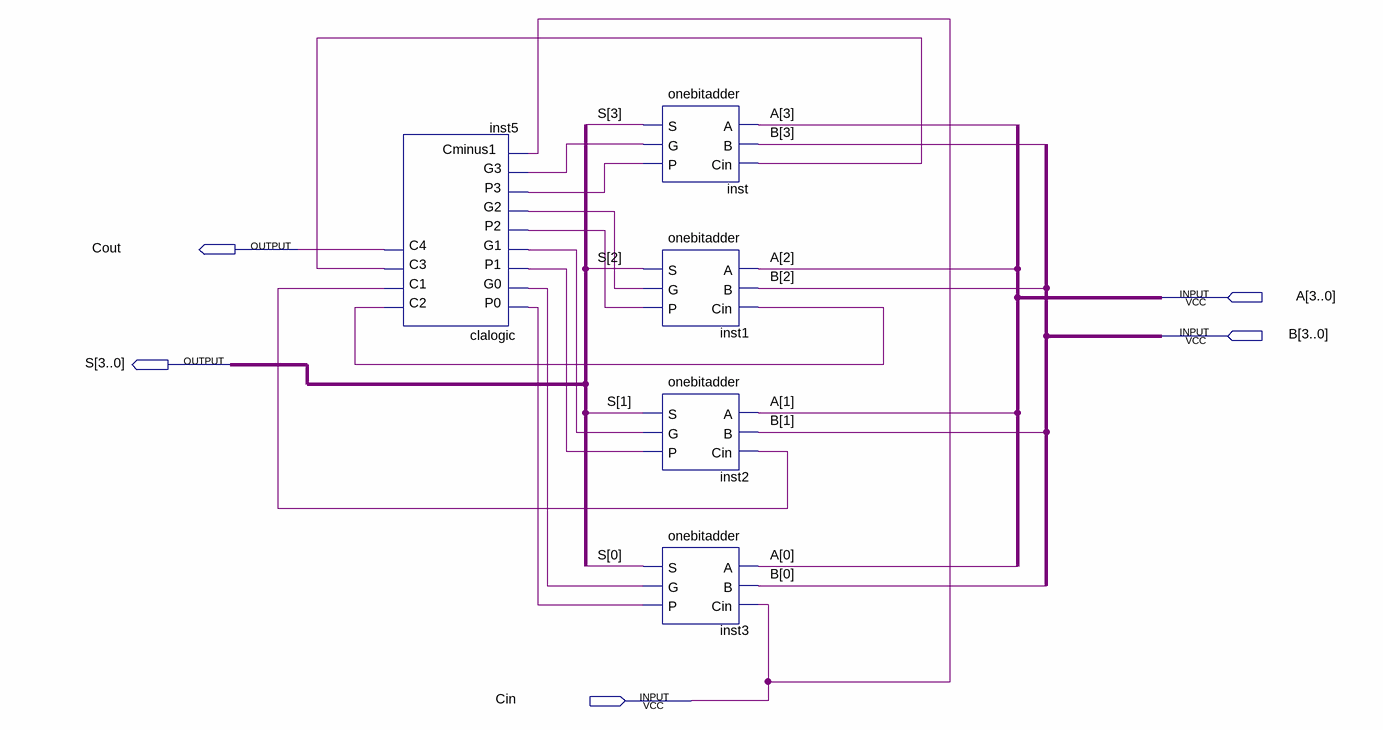
[diagram p0: schematic sheet]
// Quartus schematic finalfourbitadder.bdf as structural Verilog: 5 symbols, 5 pins
module finalfourbitadder (
  input  [3:0] A,
  input  [3:0] B,
  input  Cin,
  output Cout,
  output [3:0] S
);

  wire inst1_g, inst1_p, inst2_g, inst2_p, inst3_g, inst3_p, inst5_c1, inst5_c2, inst5_c3, inst_g, inst_p;

  clalogic inst5 (
    .P0(inst3_p), .G0(inst3_g), .P1(inst2_p), .G1(inst2_g), .P2(inst1_p), .G2(inst1_g), .P3(inst_p),
    .G3(inst_g), .Cminus1(Cin), .C2(inst5_c2), .C1(inst5_c1), .C3(inst5_c3), .C4(Cout));
  onebitadder inst (.A(A[3]), .B(B[3]), .Cin(inst5_c3), .S(S[3]), .G(inst_g), .P(inst_p));
  onebitadder inst1 (.A(A[2]), .B(B[2]), .Cin(inst5_c2), .S(S[2]), .G(inst1_g), .P(inst1_p));
  onebitadder inst2 (.A(A[1]), .B(B[1]), .Cin(inst5_c1), .S(S[1]), .G(inst2_g), .P(inst2_p));
  onebitadder inst3 (.A(A[0]), .B(B[0]), .Cin(Cin), .S(S[0]), .G(inst3_g), .P(inst3_p));
endmodule
